# EAGLE design logic_module (EAGLE 9.6.2)
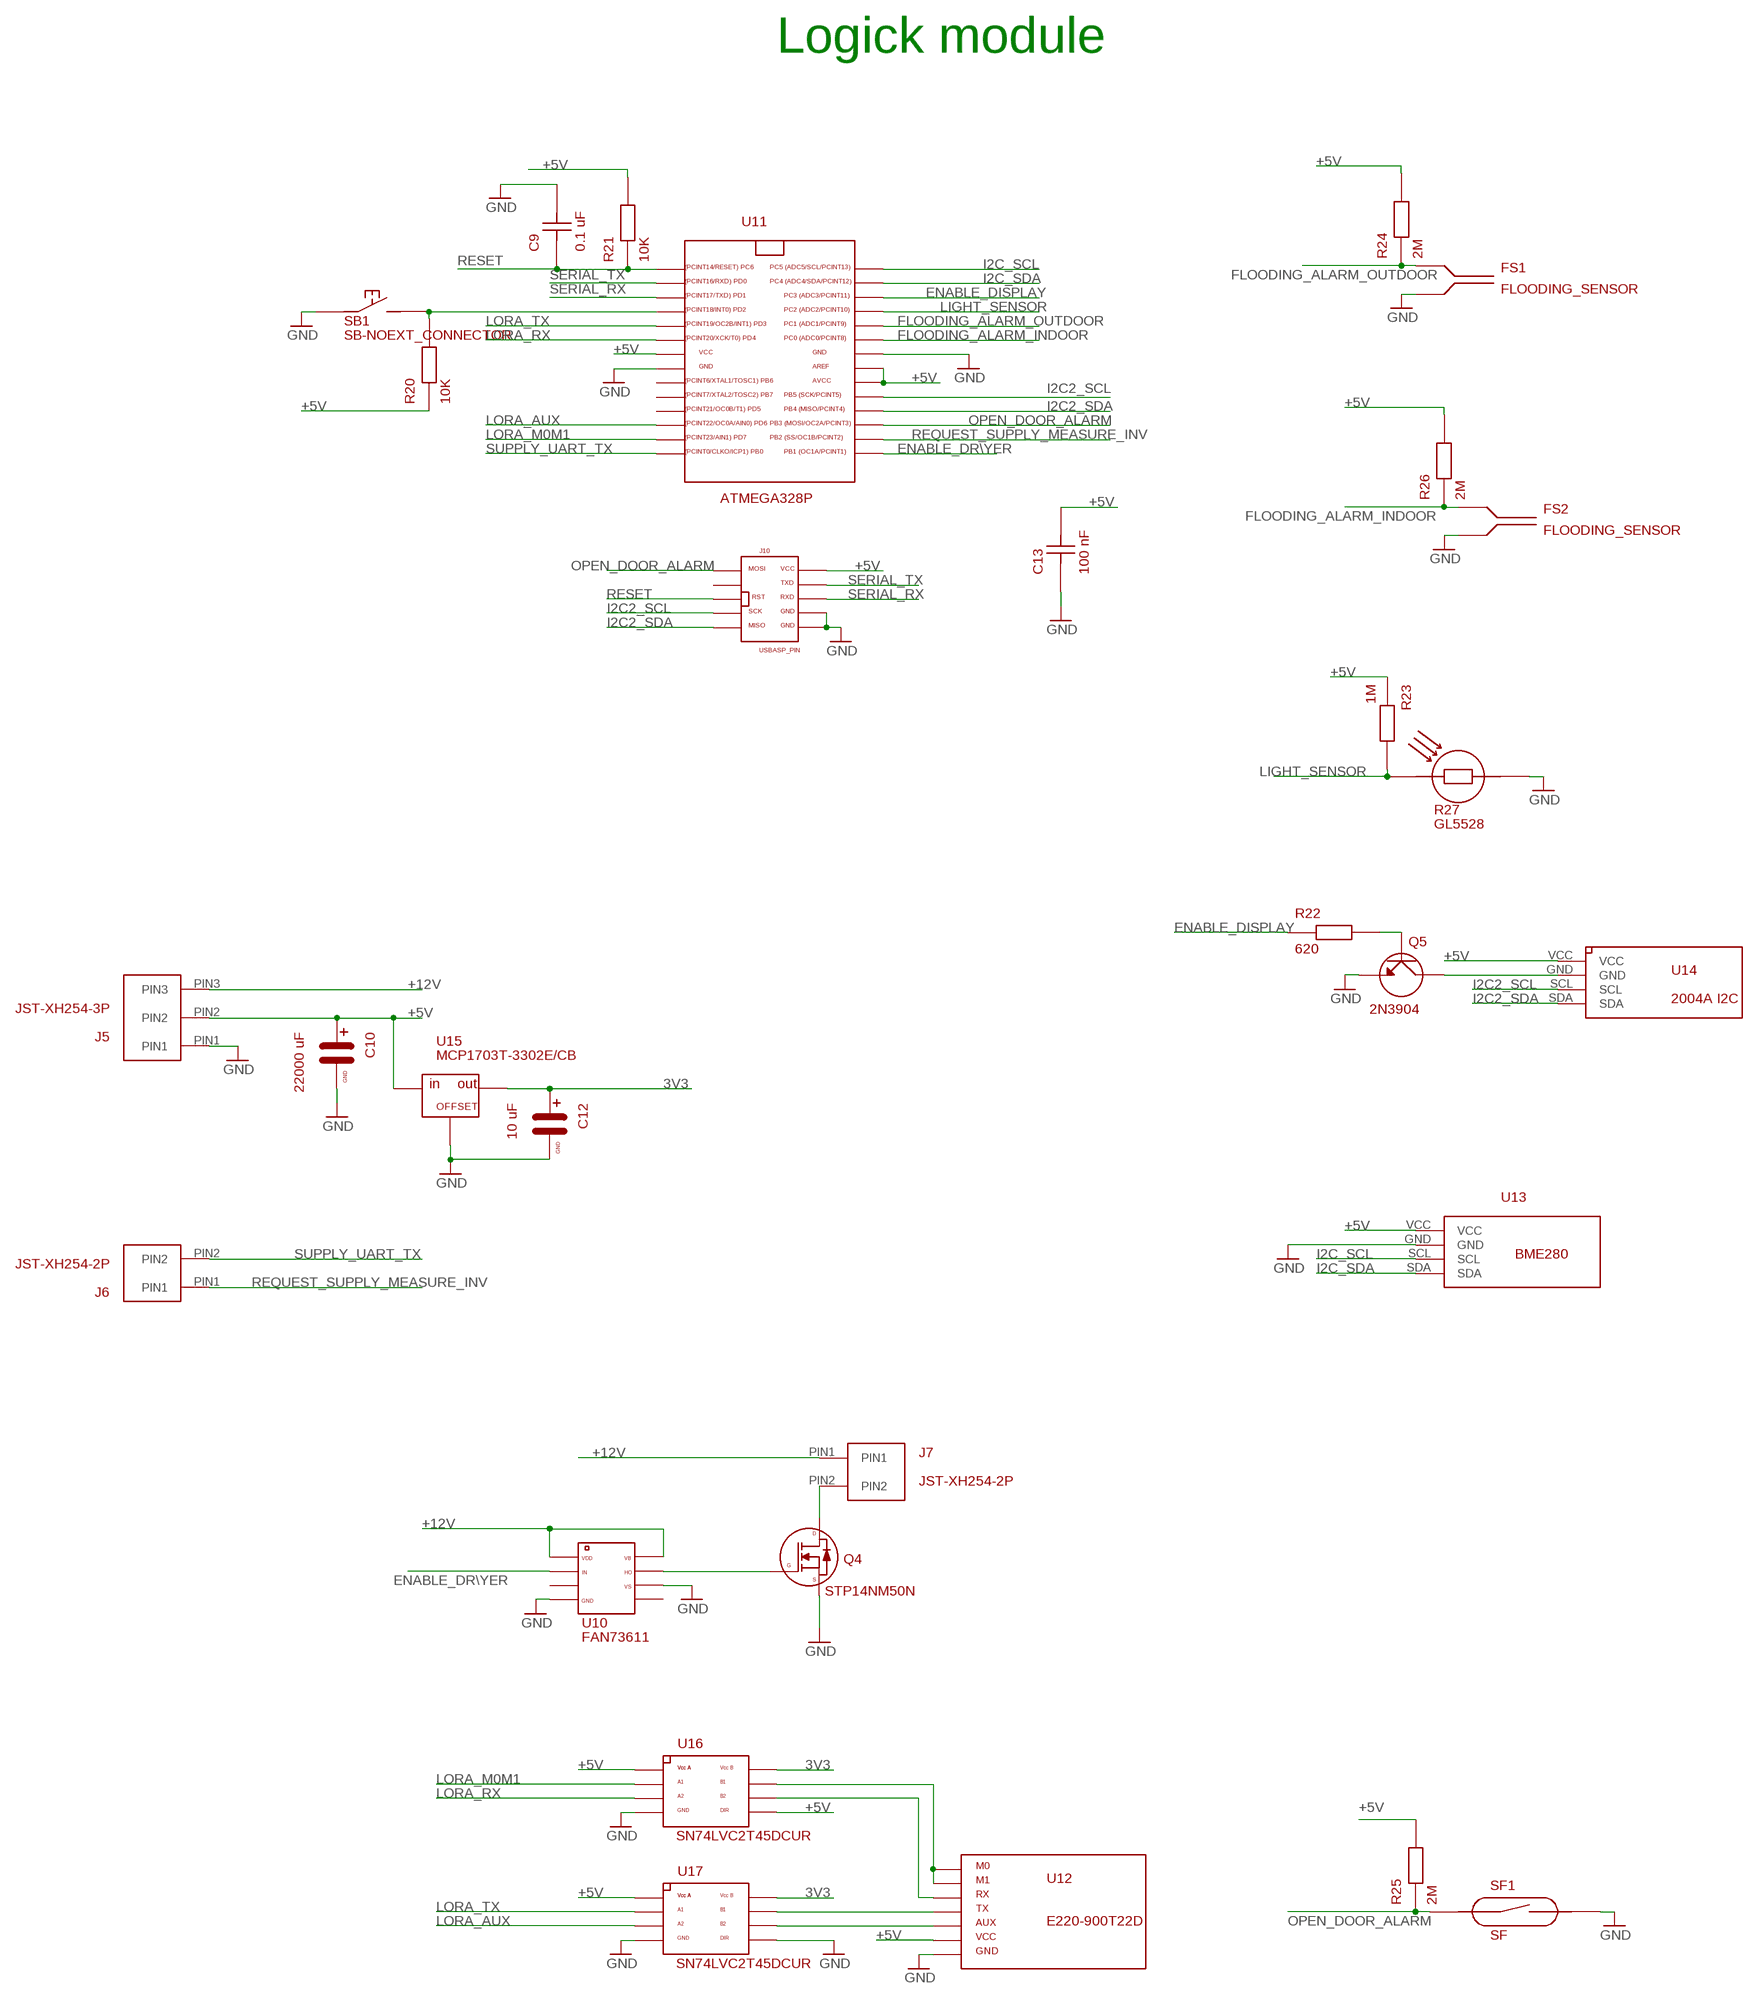
[diagram p0: schematic, sheet 1]

## Parts
C9  0.1 uF  C-1  [C-1]
C10  22000 uF  CMINI-5X7  [C-MINI-5X7]
C12  10 uF  CMINI-5X7  [C-MINI-5X7]
C13  100 nF  C-1  [C-1]
FS1  FLOODING_SENSOR  [FLOODING_SENSOR]
FS2  FLOODING_SENSOR  [FLOODING_SENSOR]
J5  JST-XH254-3P  [JST-XH254-3P]
J6  JST-XH254-2P  [JST-XH254-2P]
J7  JST-XH254-2P  [JST-XH254-2P]
J10  USBASP_PIN  [USBASP_PIN]
Q4  STP14NM50N  MOSFET_N  [MOSFET_N]
Q5  2N3904  TRANSISTOR_NPN  [TRANSISTOR]
R20  10K  R  [R]
R21  10K  R  [R]
R22  620  R  [R]
R23  1M  R  [R]
R24  2M  R  [R]
R25  2M  R  [R]
R26  2M  R  [R]
R27  GL5528  RF  [RF]
SB1  SB-NOEXT_CONNECTOR  [SB-EXT]
SF1  SF  [SF]
U10  FAN73611  [SOIC-8]
U11  ATMEGA328P  [ATMEGA328P]
U12  E220-900T22D  LORA  [LORA]
U13  BME280BME280-CONNECTOR-ONLY  [BME280-CONNECTOR-ONLY]
U14  2004A I2C  I2C_DISPLAY  [I2C_DISPLAY]
U15  MCP1703T-3302E/CB  VOLTAGE_REGULATORSOT-23A  [SOT-23A]
U16  SN74LVC2T45DCUR  LEVEL_CONVERTER_2L  [VSSOP-8]
U17  SN74LVC2T45DCUR  LEVEL_CONVERTER_2L  [VSSOP-8]

## Nets
3V3: C12.PLUS(PIN_PLUS) U15.P2(OUT) U16.P8(VCCB) U17.P8(VCCB)
+5V: C10.PLUS(PIN_PLUS) C13.P$2 J5.PIN2 J10.VCC R20.P$1 R21.P$2 R23.P$1 R24.P$2 R25.P$2 R26.P$2 U11.AREF U11.AVCC U11.VCC U12.VCC U13.VCC U14.VCC U15.P3(IN) U16.P1(VCCA) U16.P5(DIR) U17.P1(VCCA)
+12V: J5.PIN3 J7.PIN1 U10.P_1(VDD) U10.P_8(VB)
ENABLE_DISPLAY: R22.P$1 U11.PC3
ENABLE_DR\YER: U10.P_2(IN) U11.PB1
FLOODING_ALARM_INDOOR: FS2.P$1 R26.P$1 U11.PC0
FLOODING_ALARM_OUTDOOR: FS1.P$1 R24.P$1 U11.PC1
GND: C9.P$2 C10.MINUS(PIN_GND) C12.MINUS(PIN_GND) C13.P$1 FS1.P$2 FS2.P$2 J5.PIN1 J10.GND J10.GND1 Q4.S Q5.E R27.PIN2 SB1.P$1 SF1.P$2 U10.P_4(GND) U10.P_6(VS) U11.GND U11.GND1 U12.GND U13.GND U15.P1(GND) U16.P4(GND) U17.P4(GND) U17.P5(DIR)
I2C2_SCL: J10.SCK U11.PB5 U14.SCL
I2C2_SDA: J10.MISO U11.PB4 U14.SDA
I2C_SCL: U11.PC5 U13.SCL
I2C_SDA: U11.PC4 U13.SDA
LIGHT_SENSOR: R23.P$2 R27.PIN1 U11.PC2
LORA_AUX: U11.PD6 U17.P3(A2)
LORA_M0M1: U11.PD7 U16.P2(A1)
LORA_RX: U11.PD4 U16.P3(A2)
LORA_TX: U11.PD3 U17.P2(A1)
N$1: U12.TX U17.P7(B1)
N$2: U12.RX U16.P6(B2)
N$3: U12.AUX U17.P6(B2)
N$4: J7.PIN2 Q4.D
N$6: Q4.G U10.P_7(HO)
N$9: U12.M0 U12.M1 U16.P7(B1)
N$10: Q5.C U14.GND
N$11: Q5.B R22.P$2
N$16: R20.P$2 SB1.P$2 U11.PD2
OPEN_DOOR_ALARM: J10.MOSI R25.P$1 SF1.P$1 U11.PB3
REQUEST_SUPPLY_MEASURE_INV: J6.PIN1 U11.PB2
RESET: C9.P$1 J10.RST(RESET) R21.P$1 U11.PC6
SERIAL_RX: J10.RXD U11.PD1
SERIAL_TX: J10.TXD U11.PD0
SUPPLY_UART_TX: J6.PIN2 U11.PB0
Unconnected: J10.NC1 U10.P_3(NC1) U10.P_5(NC2) U11.PB6 U11.PB7 U11.PD5

## Notes on the sheet
- Logick module

## Library data of the parts
C9 C13 = my_devices:C-1
C10 C12 = my_devices:C
FS1 FS2 = my_devices:FLOODING_SENSOR
J5 = my_devices:JST-XH254-3P
J6 J7 = my_devices:JST-XH254-2P
J10 = my_devices:USBASP_PIN
Q4 = my_devices:MOSFET_N
Q5 = my_devices:TRANSISTOR_NPN
R20-R26 = my_devices:R
R27 = my_devices:RF
SB1 = my_devices:SB-NO
SF1 = my_devices:SF
U10 = my_devices:FAN73611
U11 = my_devices:ATMEGA328P
U12 = my_devices:LORA
U13 = my_devices:BME280
U14 = my_devices:I2C_DISPLAY
U15 = my_devices:VOLTAGE_REGULATOR
U16 U17 = my_devices:LEVEL_CONVERTER_2L

## Board
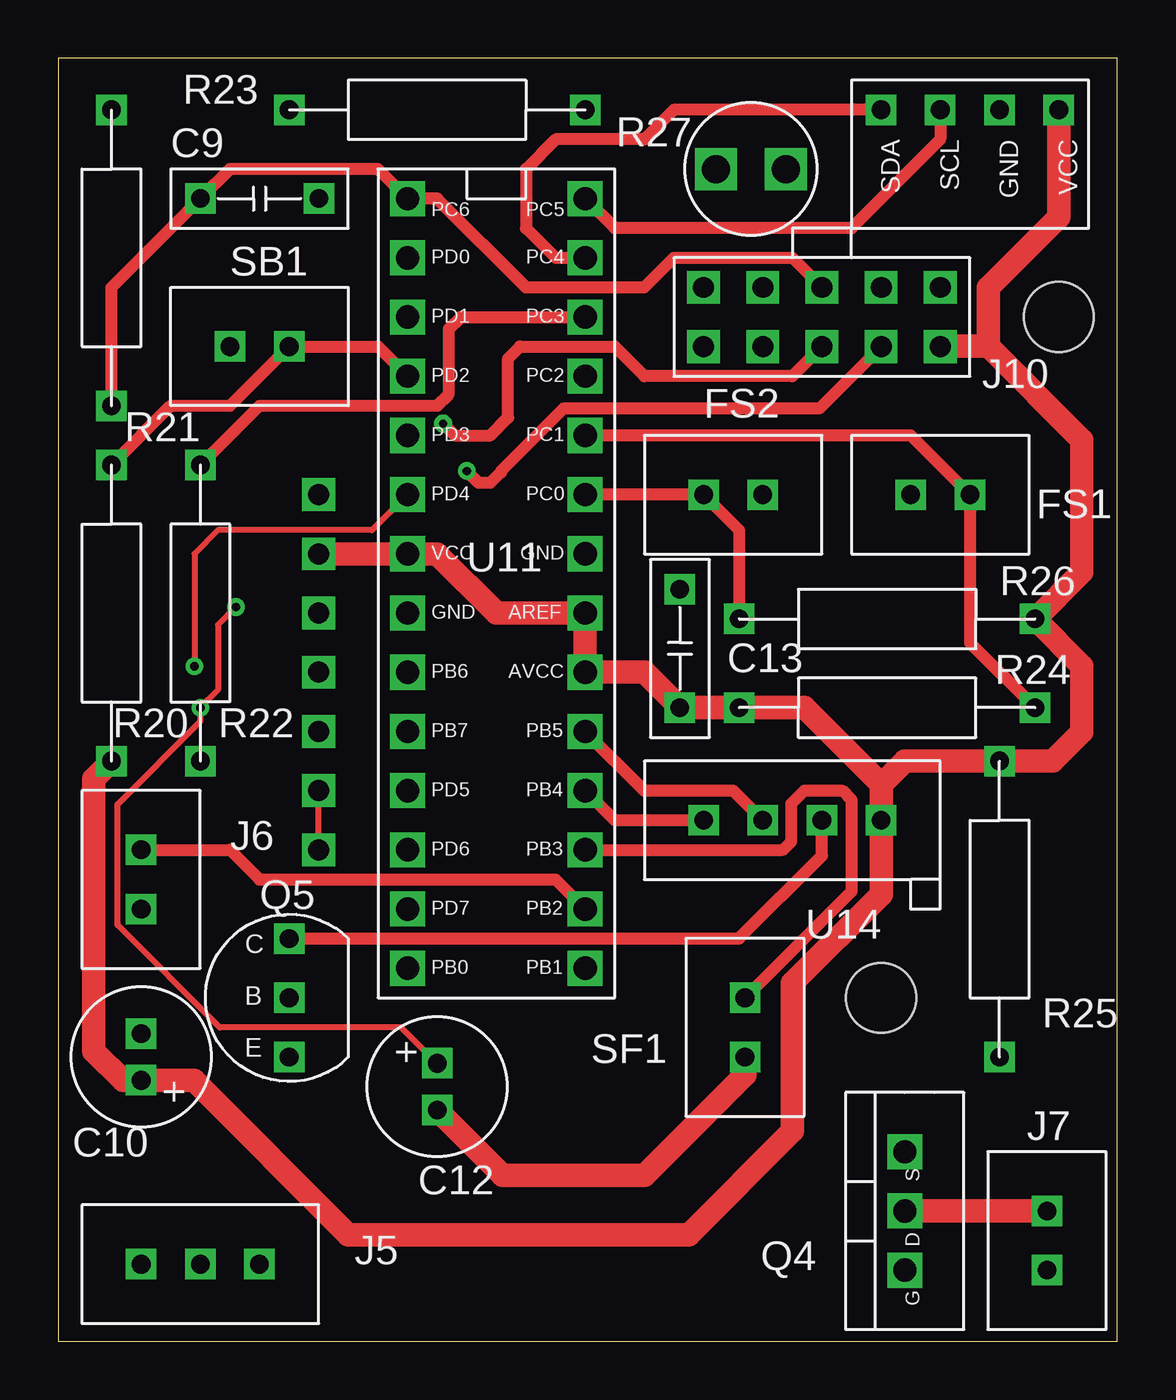
[diagram p1: board, top side]
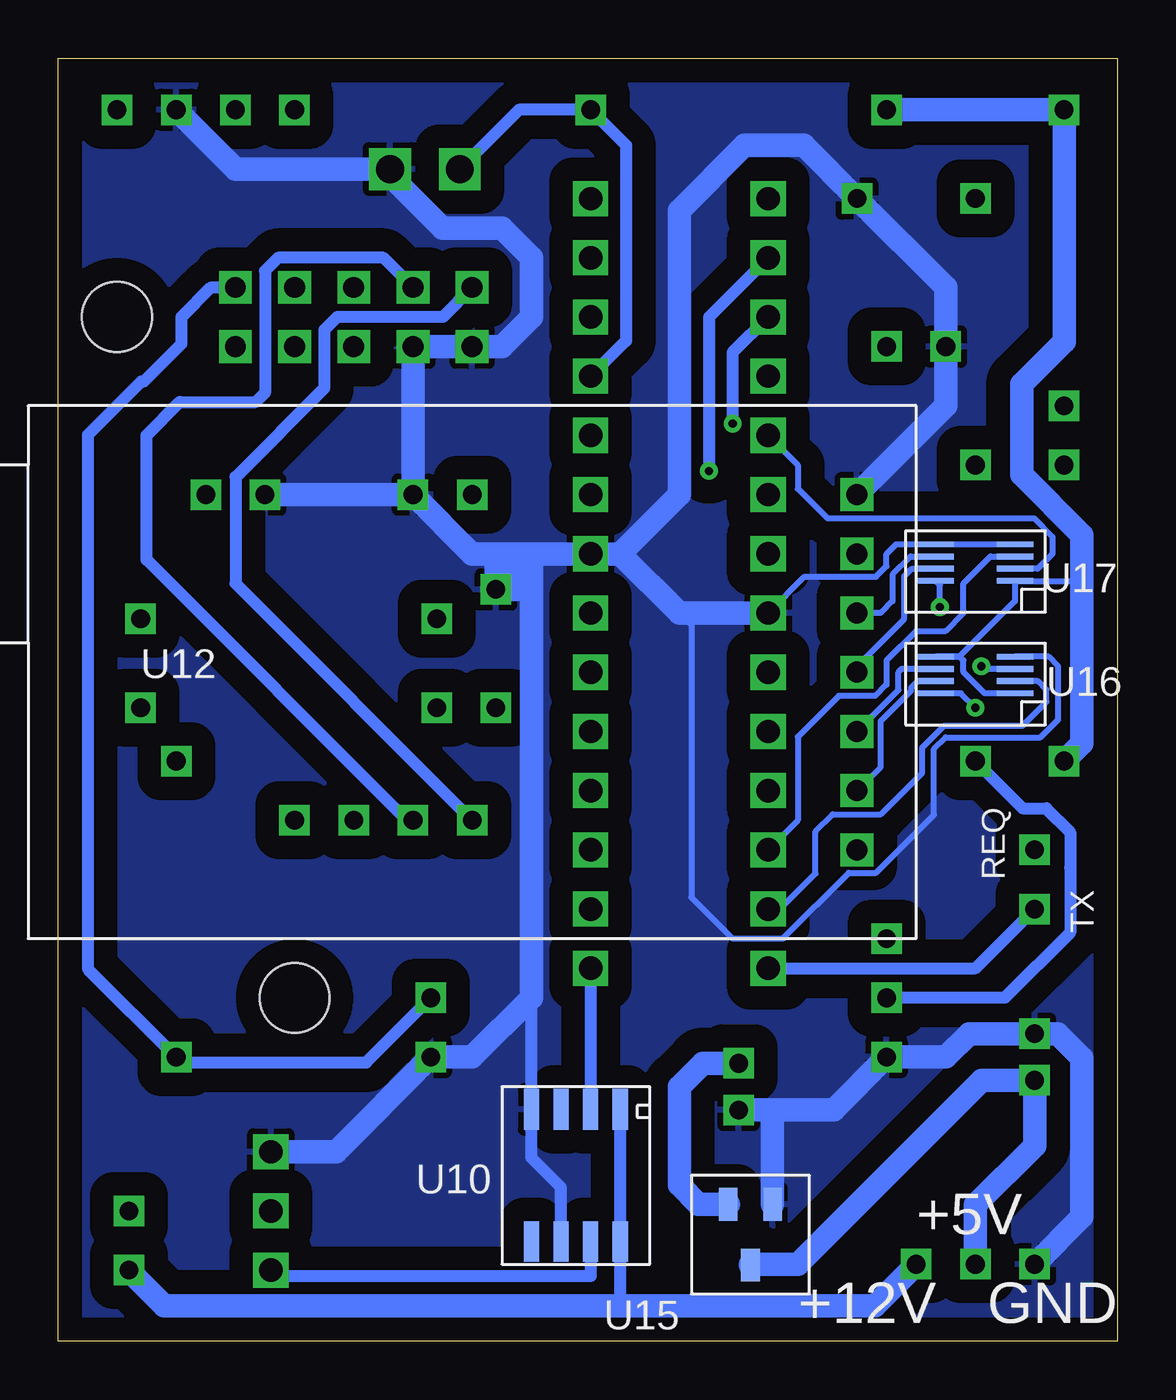
[diagram p2: board, bottom side, seen from below]

Size 45.45 x 55.04 mm. Coordinates in mm from the lower left corner, seen from the top.
Outline: 0,0 45.45,0 45.45,55.04 0,55.04 0,0
Copper layers (1*16): Top 0.035mm / dielectric 1.5mm / Bottom 0.035mm
Design rules "default": minimum track width 6mil, minimum drill 0.35mm, track to track 6mil, track to pad 6mil, pad to pad 6mil, via to via 6mil, smd to smd 6mil, copper to edge 40mil, drill to drill 6mil, minimum pad ring 10mil, minimum via ring 8mil, stop-mask expansion 4mil, vias tented up to drill 0mil, thermal gap 10mil
Holes 3 mm at 42.93,43.94 35.31,14.73

### Footprints (pad centres in the part's own frame; a part is rotated, then mirrored left to right if it is on the bottom)
C-1 = drill 0.8 square: P$1 -2.54,0; P$2 2.54,0
C-MINI-5X7 = drill 0.8 square: MINUS 1,0; PLUS -1,0
FLOODING_SENSOR = drill 0.8 square: P$1 -1.27,0; P$2 1.27,0
JST-XH254-3P = drill 0.8 square: PIN1 -2.54,0; PIN2 0,0; PIN3 2.54,0
JST-XH254-2P = drill 0.8 square: PIN1 -1.27,0; PIN2 1.27,0
USBASP_PIN = drill 0.9 square: GND 1.27,-2.54; GND1 1.27,-5.08; MISO -1.27,-5.08; MOSI -1.27,5.08; NC1 -1.27,2.54; RST -1.27,0; RXD 1.27,0; SCK -1.27,-2.54; TXD 1.27,2.54; VCC 1.27,5.08
MOSFET_N = drill 1 square: D 0,0; G -2.54,0; S 2.54,0
TRANSISTOR = drill 0.8 square: B 1.27,1.27; C 1.27,3.81; E 1.27,-1.27
R = drill 0.8 square: P$1 -6.35,0; P$2 6.35,0
RF = drill 1.2 square: PIN1 -1.5,0; PIN2 1.5,0
SB-EXT = drill 0.8 square: P$1 -1.27,0; P$2 1.27,0
SF = drill 0.8 square: P$1 -1.27,0; P$2 1.27,0
SOIC-8 = smd 1.75 x 0.65: P_1 -2.84,1.27; P_2 -2.84,0; P_3 -2.84,-1.27; P_4 -2.84,-2.54; P_5 2.84,-2.54; P_6 2.84,-1.27; P_7 2.84,0; P_8 2.84,1.27
ATMEGA328P = drill 1 square: AREF 3.81,-2.54; AVCC 3.81,-5.08; GND -3.81,-2.54; GND1 3.81,0; PB0 -3.81,-17.78; PB1 3.81,-17.78; PB2 3.81,-15.24; PB3 3.81,-12.7; PB4 3.81,-10.16; PB5 3.81,-7.62; PB6 -3.81,-5.08; PB7 -3.81,-7.62; PC0 3.81,2.54; PC1 3.81,5.08; PC2 3.81,7.62; PC3 3.81,10.16; PC4 3.81,12.7; PC5 3.81,15.24; PC6 -3.81,15.24; PD0 -3.81,12.7; PD1 -3.81,10.16; PD2 -3.81,7.62; PD3 -3.81,5.08; PD4 -3.81,2.54; PD5 -3.81,-10.16; PD6 -3.81,-12.7; PD7 -3.81,-15.24; VCC -3.81,0
LORA = drill 0.9 square: AUX 16.51,2.54; GND 16.51,7.62; M0 16.51,-7.62; M1 16.51,-5.08; RX 16.51,-2.54; TX 16.51,0; VCC 16.51,5.08
BME280-CONNECTOR-ONLY = drill 0.8 square: GND -5.08,1.27; SCL -5.08,-1.27; SDA -5.08,-3.81; VCC -5.08,3.81
I2C_DISPLAY = drill 0.8 square: GND 0,0; SCL 2.54,0; SDA 5.08,0; VCC -2.54,0
SOT-23A = smd 0.8 x 1.4: P1 -0.95,-1.3; P2 0.95,-1.3; P3 0,1.3
VSSOP-8 = smd 1.55 x 0.25: P1 -1.7,0.65; P2 -1.7,0.127; P3 -1.7,-0.396; P4 -1.7,-0.919; P5 1.7,-0.919; P6 1.7,-0.396; P7 1.7,0.127; P8 1.7,0.65

### Placement (x,y rotation side)
C9  8.64,49.02 0 top
C10  3.56,12.19 90 top
C12  16.26,10.92 270 top
C13  26.67,29.72 270 top
FS1  37.85,36.32 180 top
FS2  28.96,36.32 0 top
J5  6.1,3.3 0 top
J6  3.56,19.81 270 top
J7  42.42,4.32 90 top
J10  32.77,43.94 270 top
Q4  36.32,5.59 90 top
Q5  8.64,13.46 0 top
R20  2.29,31.24 90 top
R21  2.29,46.48 90 top
R22  6.1,31.24 270 top
R23  16.26,52.83 0 top
R24  35.56,27.18 180 top
R25  40.39,18.54 90 top
R26  35.56,30.99 0 top
R27  29.72,50.29 0 top
SB1  8.64,42.67 0 top
SF1  29.46,13.46 270 top
U10  22.61,7.11 270 bottom
U11  18.8,33.78 0 top
U12  27.69,28.7 0 bottom
U13  39.12,47.75 270 top
U14  32.77,22.35 180 top
U15  15.75,4.57 180 bottom
U16  6.1,28.45 180 bottom
U17  6.1,33.27 180 bottom

### Tracks (layer width: path | path; a pad name or v marks a point on that pad's centre or on a via)
3V3  (via drill 0.35)
  Top 0.254: C12.PLUS 14.72,13.46 6.93,13.46 2.54,17.85 2.54,23.04 6.1,26.59 v6.1,27.18 6.86,27.94 6.86,30.73 v7.62,31.5
  Bottom 0.254: v7.62,31.5 7.62,32.45 U17.P8 | v6.1,27.18 6.72,27.8 U16.P8
  Bottom 1.016: C12.PLUS 17.8,11.92 18.8,10.92 18.8,6.7 17.97,5.87 U15.P2
+5V
  Top 1.016: 35.31,23.88 U14.VCC 35.31,19.18 31.5,15.37 31.5,9.02 27.05,4.57 12.45,4.57 5.83,11.19 C10.PLUS 2.78,11.19 1.52,12.45 1.52,24.13 R20.P$1 | 35.31,23.88 36.32,24.89 R25.P$2 42.67,24.89 43.92,26.14 43.92,28.98 R26.P$2 43.92,33 43.92,38.67 39.9,42.69 | U13.VCC 42.93,48.22 39.9,45.2 39.9,42.69 | J10.VCC 37.86,42.69 39.9,42.69 | U12.VCC U11.VCC 16.26,33.78 18.8,31.24 U11.AREF U11.AVCC 25.15,28.7 C13.P$2 R24.P$2 32,27.18 35.31,23.88
  Bottom 0.254: 1.52,32.51 1.64,32.62 U17.P1 4.4,31.75 6.78,29.37 U16.P5 6.76,29.37 6.6,29.21 6.6,28.7 5.7,27.8 U16.P1
  Bottom 1.016: R23.P$1 R21.P$2 2.29,42.88 4.11,41.06 4.11,37.17 1.52,34.59 1.52,32.51 1.52,25.65 R20.P$1 | J5.PIN2 6.1,5.84 3.56,8.38 C10.PLUS 5.83,11.19 13.72,3.3 15.72,3.3 U15.P3
+12V
  Bottom 0.508: U10.P_1 U10.P_8 21.34,1.52
  Bottom 1.016: J5.PIN3 10.41,1.52 21.34,1.52 40.89,1.52 J7.PIN1
ENABLE_DISPLAY
  Top 0.508: R22.P$1 8.64,40.13 16.26,40.13 16.76,40.64 16.76,43.43 17.27,43.94 U11.PC3
ENABLE_DR\YER
  Bottom 0.508: U11.PB1 U10.P_2
FLOODING_ALARM_INDOOR
  Top 0.508: U11.PC0 FS2.P$1 29.21,34.8 R26.P$1
FLOODING_ALARM_OUTDOOR
  Top 0.508: U11.PC1 36.58,38.86 FS1.P$1 39.12,29.97 R24.P$1
GND
  Top 1.016: C12.MINUS 19.07,7.11 25.15,7.11 29.46,11.43 SF1.P$2
  Bottom 0.254: 18.8,31.24 18.29,30.73 18.29,19.05 16.51,17.27 14.35,17.27 11.53,20.1 10.36,20.1 7.87,22.58 7.87,25.4 7.37,25.91 3.3,25.91 2.54,26.67 2.54,28.96 2.95,29.37 U16.P4 | U17.P4 U17.P5 9.5,34.19 9.91,33.78 9.91,33.25 10.36,32.8 13.43,32.8 U11.GND
  Bottom 0.508: U10.P_6 23.88,6.6 25.15,7.87 U10.P_4 25.15,14.73
  Bottom 1.016: 21.34,33.78 18.8,31.24 U11.GND | 21.34,33.78 U11.GND1 25.15,33.78 | U13.GND 37.85,50.29 R27.PIN2 31.22,50.01 28.96,47.75 26.42,47.75 25.15,46.48 25.15,43.94 26.42,42.67 J10.GND1 J10.GND FS2.P$2 | FS1.P$2 FS2.P$2 | 25.15,33.78 26.67,33.78 | 26.67,33.78 27.69,33.78 FS2.P$2 | U12.GND 7.37,40.13 SB1.P$1 7.37,45.21 C9.P$2 13.46,51.31 16,51.31 18.8,48.51 18.8,36.32 21.34,33.78 | J5.PIN1 1.52,5.33 1.52,12.16 2.55,13.19 C10.MINUS 6.37,13.19 7.37,12.19 Q5.E 12.18,9.92 C12.MINUS 14.8,9.92 U15.P1 | 25.15,33.78 25.15,32.26 | 25.15,32.26 25.15,14.73 27.69,12.19 SF1.P$2 33.53,8.13 Q4.S | C13.P$1 25.15,32.26 | C13.P$1 26.67,33.78 | C13.P$1 25.91,33.02
  pour Bottom (isolate 1.016): 1.02,54.1 45.47,54.1 45.47,0.25 1.02,0.25
I2C2_SCL
  Top 0.508: U14.SCL 28.96,23.62 25.15,23.62 U11.PB5
  Bottom 0.508: J10.SCK 31.5,46.48 36.02,46.48 36.58,45.92 36.58,40.69 36.97,40.29 40.23,40.29 41.66,38.86 41.66,33.53 30.48,22.35 U14.SCL
I2C2_SDA
  Top 0.508: U14.SDA 23.88,22.35 U11.PB4
  Bottom 0.508: J10.MISO 28.96,43.94 33.48,43.94 34.04,43.38 34.04,40.89 37.85,37.08 37.85,32.51 U14.SDA
I2C_SCL
  Top 0.508: U13.SCL 37.85,51.56 34.04,47.75 23.88,47.75 U11.PC5
I2C_SDA
  Top 0.508: U11.PC4 21.34,46.48 20.07,47.75 20.07,50.29 21.34,51.56 25.15,51.56 26.42,52.83 U13.SDA
LIGHT_SENSOR
  Bottom 0.508: U11.PC2 21.08,42.93 21.08,51.31 R23.P$2 25.68,52.83 R27.PIN1
LORA_AUX
  Bottom 0.254: U11.PD6 13.72,22.35 13.72,25.93 11.96,27.69 10.39,27.69 9.91,28.17 9.91,29.21 8.64,30.48 7.37,30.48 6.6,31.24 6.6,32.51 5.45,33.67 U17.P3
LORA_M0M1
  Bottom 0.254: U11.PD7 14.48,18.54 12.95,20.07 12.95,21.87 12.22,22.61 10.16,22.61 8.38,24.38 8.38,25.47 7.43,26.42 4.06,26.42 3.05,27.43 3.05,27.94 3.43,28.32 U16.P2
LORA_RX  (via drill 0.35)
  Top 0.254: v5.84,28.96 5.84,33.78 6.86,34.8 13.46,34.8 U11.PD4
  Bottom 0.254: U16.P3 5.73,28.84 v5.84,28.96
LORA_TX
  Bottom 0.254: U11.PD3 13.72,37.59 13.72,36.58 12.45,35.31 3.58,35.31 2.79,34.52 2.79,33.78 3.43,33.15 U17.P2
N$1
  Bottom 0.254: U12.TX 11.18,28.96 9.14,30.99 9.14,32.83 8.82,33.15 U17.P7
N$2
  Bottom 0.254: U12.RX 9.4,27.94 9.4,28.7 9.25,28.85 8.72,28.85 8.71,28.84 U16.P6
N$3
  Bottom 0.254: U12.AUX 10.16,31.24 9.65,31.75 9.65,32.89 8.87,33.67 U17.P6
N$4
  Top 1.016: Q4.D J7.PIN2
N$6
  Bottom 0.508: U10.P_7 22.61,2.79 36.07,2.79 Q4.G
N$9
  Top 0.254: U12.M0 U12.M1
  Bottom 0.254: U12.M1 10.16,24.64 10.16,26.6 8.85,27.91 8.85,28.04 8.57,28.32 U16.P7
N$10
  Top 0.508: U14.GND 32.77,20.83 29.21,17.27 Q5.C
N$11
  Bottom 0.508: R22.P$2 4.06,22.86 3.05,22.86 2.03,21.84 2.03,20.32 | 2.03,20.32 2.03,17.53 4.83,14.73 Q5.B | 2.03,20.32
N$16
  Top 0.508: R20.P$2 4.83,40.13 7.37,40.13 SB1.P$2 13.72,42.67 U11.PD2
OPEN_DOOR_ALARM
  Top 0.508: U11.PB3 31.09,21.08 31.45,21.44 31.45,23.07 32,23.62 33.63,23.62 34.04,23.22 34.04,19.3 SF1.P$1
  Bottom 0.508: J10.MOSI 38.89,45.21 40.16,43.94 40.16,42.8 41.78,41.17 41.89,41.17 44.18,38.88 44.18,15.98 R25.P$1 40.16,11.96 32.23,11.96 SF1.P$1
REQUEST_SUPPLY_MEASURE_INV
  Top 0.508: J6.PIN1 7.37,21.08 8.64,19.81 21.34,19.81 U11.PB2
RESET
  Top 0.508: J10.RST 31.5,46.48 26.42,46.48 25.15,45.21 20.07,45.21 16.26,49.02 U11.PC6 13.72,50.29 7.37,50.29 C9.P$1 2.29,45.21 R21.P$1
SERIAL_RX  (via drill 0.35)
  Top 0.508: J10.RXD 31.5,41.4 25.15,41.4 23.88,42.67 19.81,42.67 19.3,42.16 19.3,39.62 18.54,38.86 17.02,38.86 v16.51,39.37
  Bottom 0.508: U11.PD1 16.51,42.42 v16.51,39.37
SERIAL_TX  (via drill 0.35)
  Top 0.508: J10.TXD 32.66,40.02 21.68,40.02 19,37.34 19,37.29 18.54,36.83 18.03,36.83 v17.53,37.34
  Bottom 0.508: U11.PD0 17.53,43.94 v17.53,37.34
SUPPLY_UART_TX
  Bottom 0.508: U11.PB0 6.1,16 J6.PIN2

### Text on the board
bPlace: U16
bNames: REQ | TX | +5V | GND | +12V